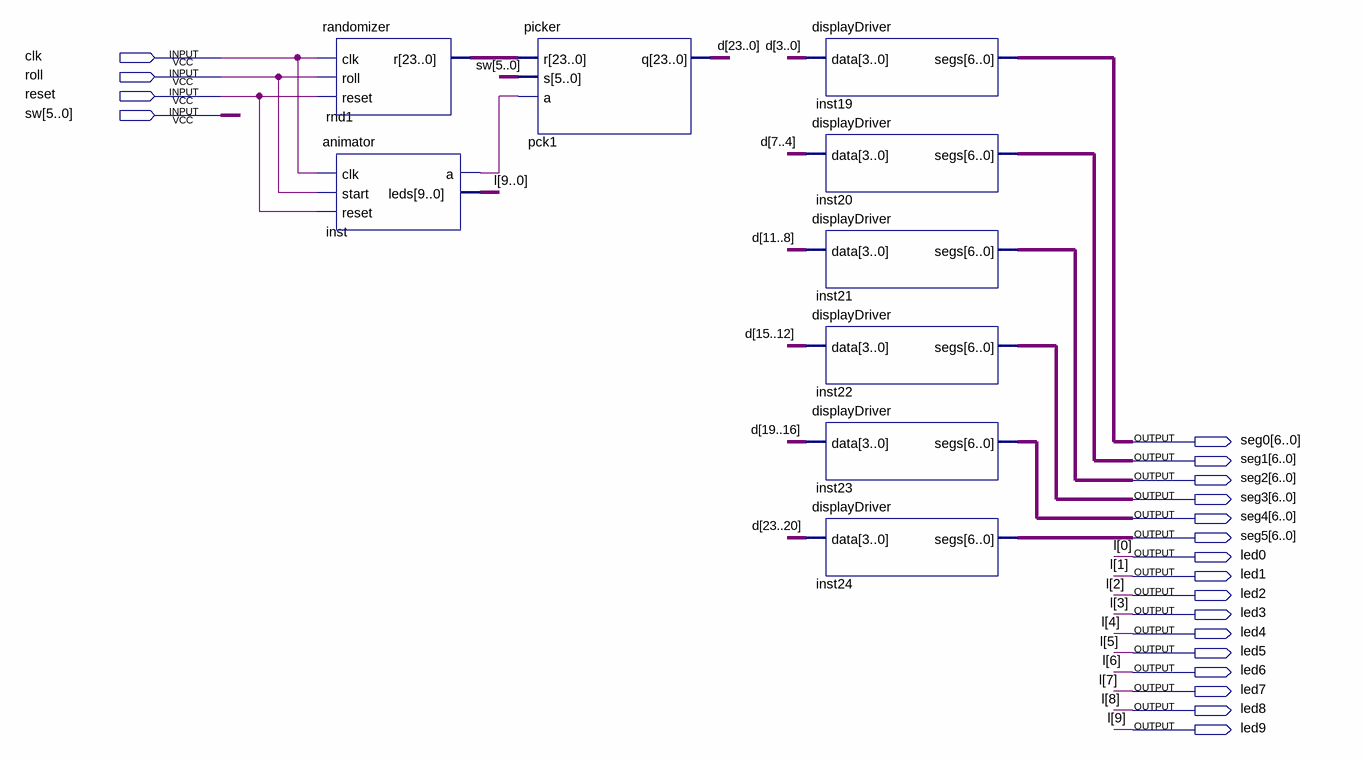
[diagram p0: schematic sheet]
// Quartus schematic diceMachine.bdf as structural Verilog: 9 symbols, 20 pins
module diceMachine (
  input  clk,
  input  roll,
  input  reset,
  input  [5:0] sw,
  output [6:0] seg0,
  output [6:0] seg1,
  output [6:0] seg2,
  output [6:0] seg3,
  output [6:0] seg4,
  output [6:0] seg5,
  output led0,
  output led1,
  output led2,
  output led3,
  output led4,
  output led5,
  output led6,
  output led7,
  output led8,
  output led9
);

  wire inst_a;
  wire [23:0] d, rnd1_r;

  randomizer rnd1 (.clk(clk), .roll(roll), .reset(reset), .r(rnd1_r));
  animator inst (
    .clk(clk), .start(roll), .reset(reset), .a(inst_a),
    .leds({led9, led8, led7, led6, led5, led4, led3, led2, led1, led0}));
  picker pck1 (.r(rnd1_r), .s(sw), .a(inst_a), .q(d));
  displayDriver inst19 (.data(d[3:0]), .segs(seg0));
  displayDriver inst20 (.data(d[7:4]), .segs(seg1));
  displayDriver inst21 (.data(d[11:8]), .segs(seg2));
  displayDriver inst22 (.data(d[15:12]), .segs(seg3));
  displayDriver inst23 (.data(d[19:16]), .segs(seg4));
  displayDriver inst24 (.data(d[23:20]), .segs(seg5));

  // Other names for the same wires on the sheet: l[9:0] = {led9, led8, led7, led6, led5, led4, led3, led2, led1, led0}
endmodule
